# EAGLE schematic Transmissometer_RX_Boardv1 (EAGLE 6.1)
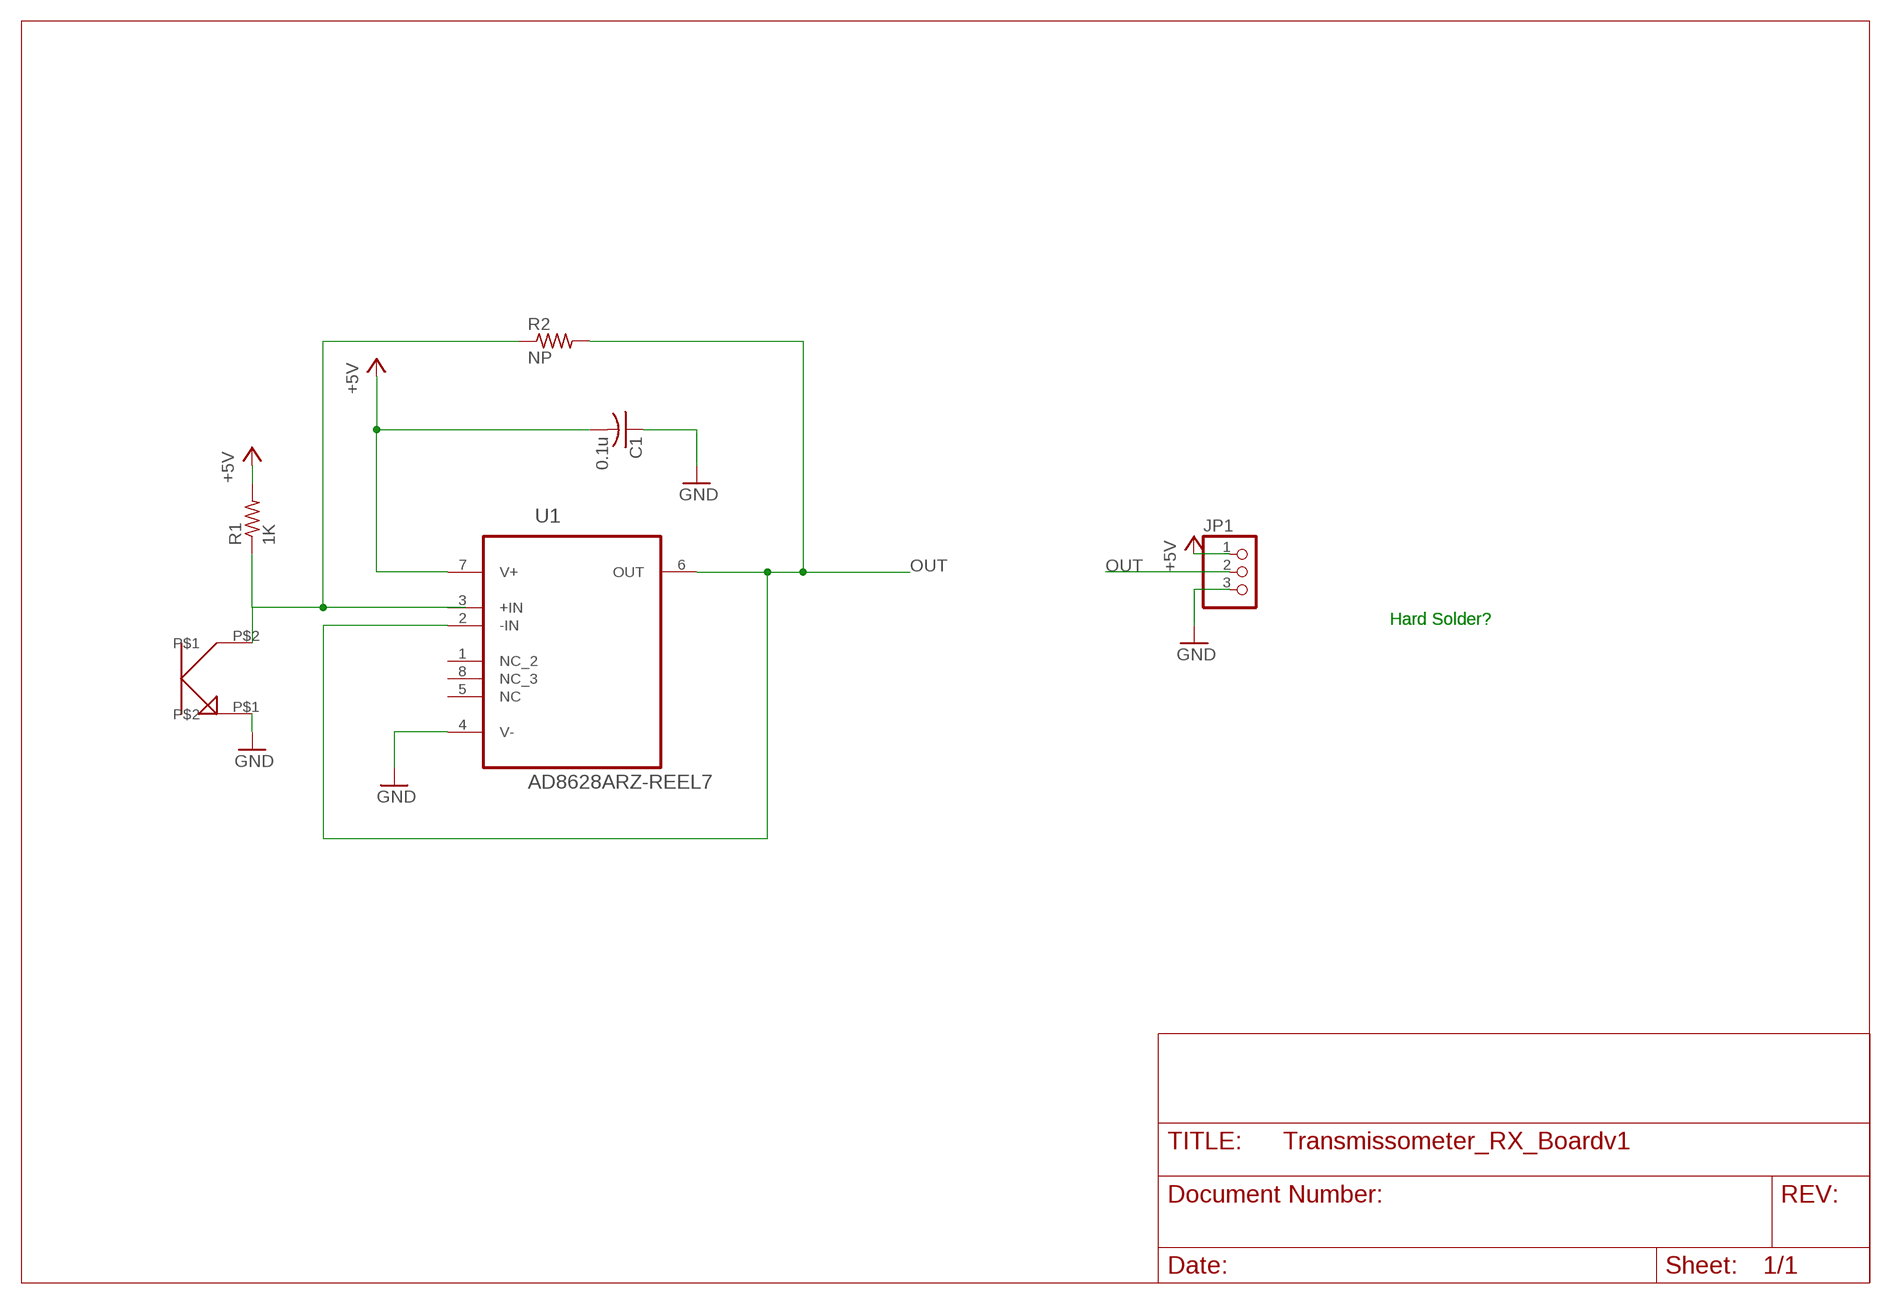
[diagram p0: schematic, sheet 1]

## Parts
C1  0.1u  C-USC0805  [C0805]
JP1  PINHD-1X3  [1X03]
R1  1K  R-US_R0805  [R0805]
R2  NP  R-US_R0805  [R0805]
U1  AD8628ARZ-REEL7  [SOIC127P600X175-8N]
U$1  TEMPT1020  [TEMPT1020]

## Nets
+5V: C1.2 JP1.1 R1.2 U1.7(V+)
GND: C1.1 JP1.3 U1.4(V-) U$1.P$1
N$4: R1.1 R2.1 U1.3(+IN) U$1.P$2
OUT: JP1.2 R2.2 U1.2(-IN) U1.6(OUT)
Unconnected: U1.1(NC_2) U1.5(NC) U1.8(NC_3)

## Notes on the sheet
- Hard Solder? | Hard Solder?

## Library data of the parts
C1 = resistor:C-US: CAPACITOR, American symbol
JP1 = pinhead:PINHD-1X3: PIN HEADER
R1 R2 = resistor:R-US_: RESISTOR, American symbol
U1 = ADI-Phase-2:AD8628ARZ-REEL7: Operational Amplifiers; MPN: AD8628ARZ-REEL7; OC_FARNELL: unknown; OC_NEWARK: 59K6999; PACKAGE: SOIC-8; SUPPLIER: Analog Devices
U$1 = Personal:TEMPT1020